# Altium schematic sheet DC CV - SCH.SchDoc
size Legal
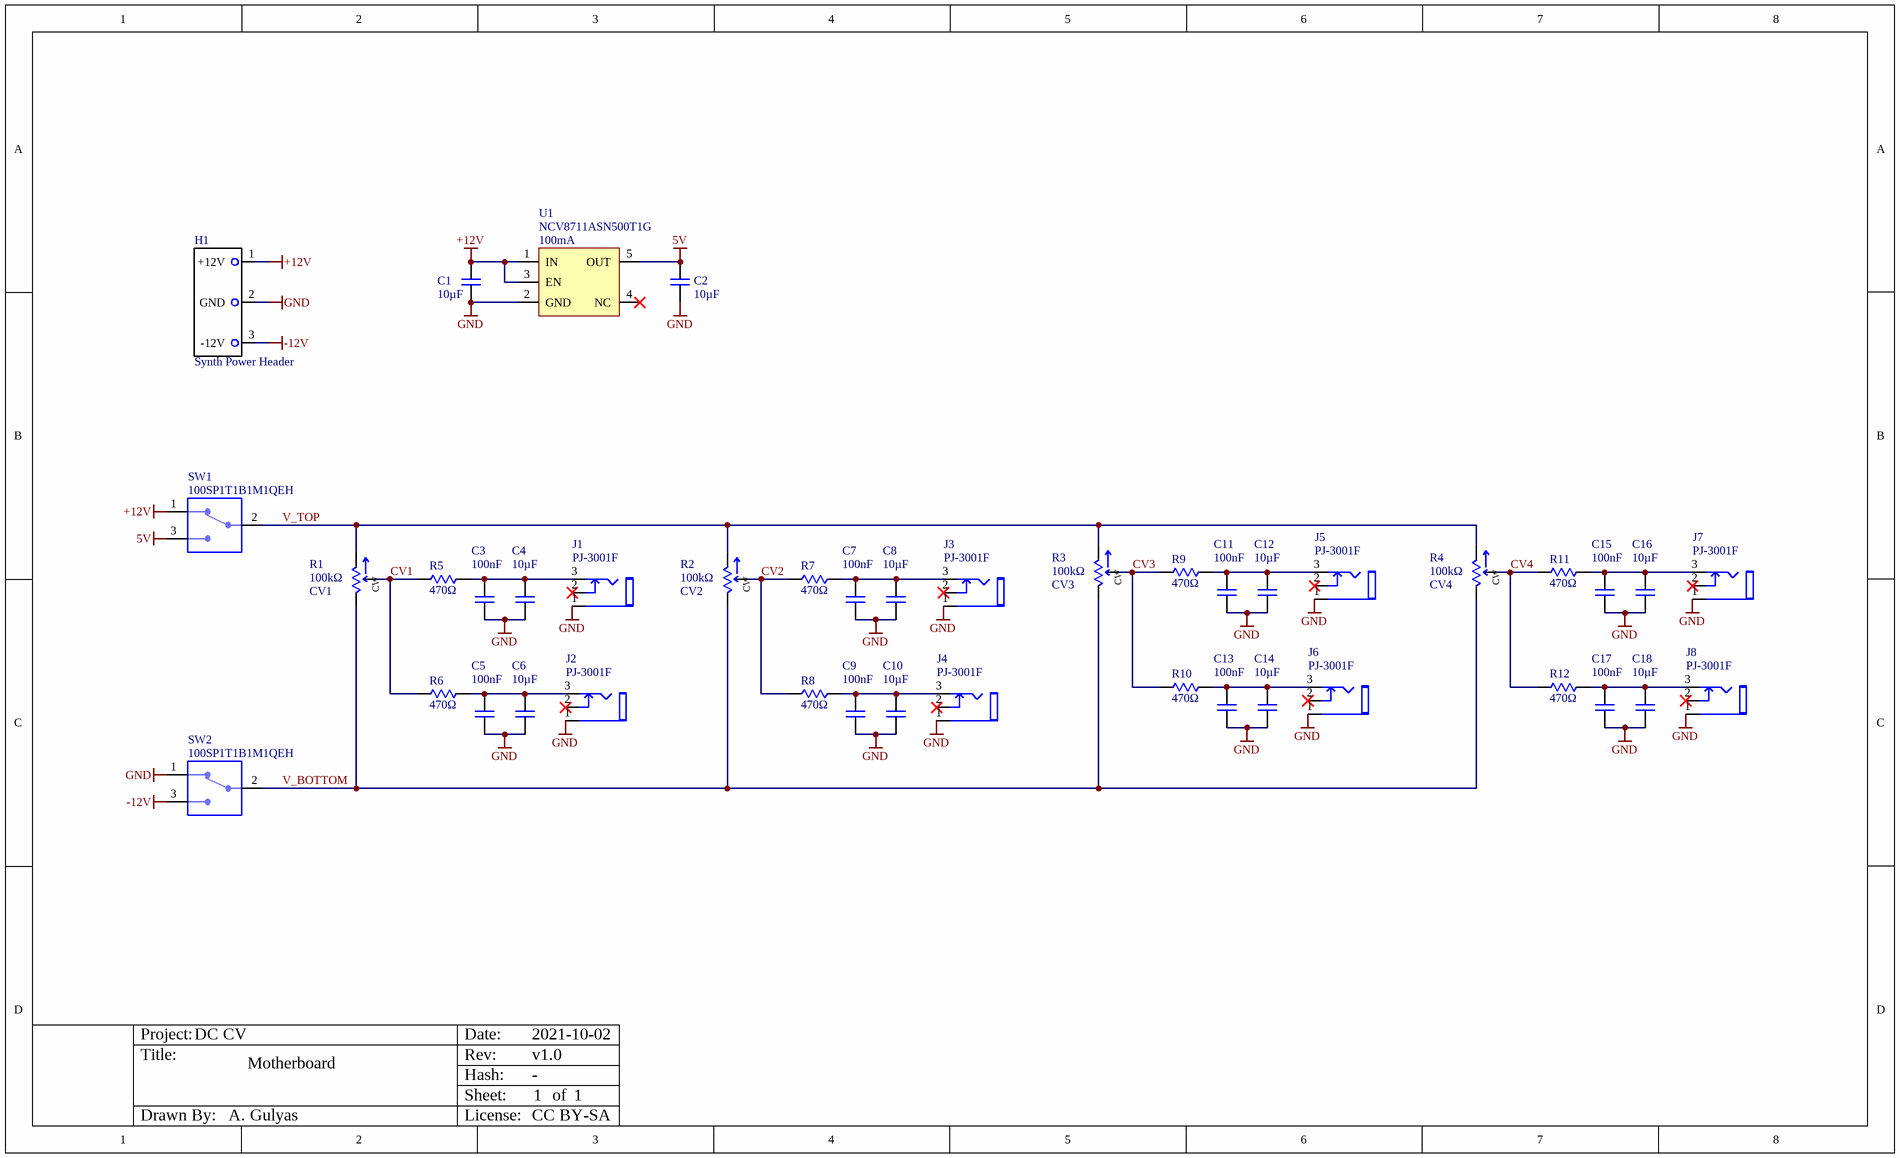
[diagram p0: DC CV - SCH.SchDoc]

## Parts
C1  10µF  [0805 - C]
C2  10µF  [0805 - C]
C3  100nF  [0603 - C]
C4  10µF  [0805 - C]
C5  100nF  [0603 - C]
C6  10µF  [0805 - C]
C7  100nF  [0603 - C]
C8  10µF  [0805 - C]
C9  100nF  [0603 - C]
C10  10µF  [0805 - C]
C11  100nF  [0603 - C]
C12  10µF  [0805 - C]
C13  100nF  [0603 - C]
C14  10µF  [0805 - C]
C15  100nF  [0603 - C]
C16  10µF  [0805 - C]
C17  100nF  [0603 - C]
C18  10µF  [0805 - C]
H1  Synth Power Header  [Eurorack power - 10 pin - DC CV]
J1  PJ-3001F  [Jack - TS - PJ-3001F]
J2  PJ-3001F  [Jack - TS - PJ-3001F]
J3  PJ-3001F  [Jack - TS - PJ-3001F]
J4  PJ-3001F  [Jack - TS - PJ-3001F]
J5  PJ-3001F  [Jack - TS - PJ-3001F]
J6  PJ-3001F  [Jack - TS - PJ-3001F]
J7  PJ-3001F  [Jack - TS - PJ-3001F]
J8  PJ-3001F  [Jack - TS - PJ-3001F]
R1  100kΩ  Purpose: CV1  [Pot - P0915N]
R2  100kΩ  Purpose: CV2  [Pot - P0915N]
R3  100kΩ  Purpose: CV3  [Pot - P0915N]
R4  100kΩ  Purpose: CV4  [Pot - P0915N]
R5  470Ω  [0603 - R]
R6  470Ω  [0603 - R]
R7  470Ω  [0603 - R]
R8  470Ω  [0603 - R]
R9  470Ω  [0603 - R]
R10  470Ω  [0603 - R]
R11  470Ω  [0603 - R]
R12  470Ω  [0603 - R]
SW1  100SP1T1B1M1QEH  [SW - 100SP1T1B1M1QEH]
SW2  100SP1T1B1M1QEH  [SW - 100SP1T1B1M1QEH]
U1  NCV8711ASN500T1G  Current - Output: 100mA  [TSOT 23 5]

## Nets
5V: C2.1 SW1.3 U1.5(OUT)
+12V: C1.1 H1.1(+12V) SW1.1 U1.1(IN) U1.3(EN)
-12V: H1.3(-12V) SW2.3
GND: C1.2 C2.2 C3.2 C4.2 C5.2 C6.2 C7.2 C8.2 C9.2 C10.2 C11.2 C12.2 C13.2 C14.2 C15.2 C16.2 C17.2 C18.2 H1.2(GND) J1.1 J2.1 J3.1 J4.1 J5.1 J6.1 J7.1 J8.1 SW2.1 U1.2(GND)
CV1: R1.2 R5.1 R6.1
CV2: R2.2 R7.1 R8.1
CV3: R3.2 R9.1 R10.1
CV4: R4.2 R11.1 R12.1
V_BOTTOM: R1.1 R2.1 R3.1 R4.1 SW2.2
V_TOP: R1.3 R2.3 R3.3 R4.3 SW1.2
NetC3_1: C3.1 C4.1 J1.3 R5.2
NetC5_1: C5.1 C6.1 J2.3 R6.2
NetC7_1: C7.1 C8.1 J3.3 R7.2
NetC9_1: C9.1 C10.1 J4.3 R8.2
NetC11_1: C11.1 C12.1 J5.3 R9.2
NetC13_1: C13.1 C14.1 J6.3 R10.2
NetC15_1: C15.1 C16.1 J7.3 R11.2
NetC17_1: C17.1 C18.1 J8.3 R12.2

Not connected (* = marked no-connect by the designer): J1 2*; J2 2*; J3 2*; J4 2*; J5 2*; J6 2*; J7 2*; J8 2*; U1 4(NC)*

## Notes on the sheet
- Project:
- DC CV
- Date:
- 2021-10-02
- Title:
- Motherboard
- Rev:
- Hash:
- Sheet:
- v1.0
- -
- 1
- of
- Drawn By:
- A. Gulyas
- License:
- CC BY-SA
- (in symbol R - pot - 100k) CW

## Library data of the parts
C1 C2 C4 C6 C8 C10 C12 C14 C16 C18 = C - 0805 - 10uF - 16V: CAP CER 10UF 16V X5R 0805; MFG: Yageo; MFG PN: CC0805MKX5R7BB106; Tolerance: ±20%; Op Temp: -55°C ~ 85°C; Digi-Key PN: 311-3430-1-ND; Value: 10µF; Package: 0805; Temp Coeff: X5R; Series: CC; Price/1 @10: $0.352; Height: 1.45mm; Composition: ceramic; Voltage - Rated: 16V; Mounting Type: Surface Mount, MLCC
C3 C5 C7 C9 C11 C13 C15 C17 = C - 0603 - 100nF - 16V: CAP CER 0.1UF 16V X7R 0603; MFG: Yageo; MFG PN: CC0603KRX7R7BB104; Value: 0.1µF; Tolerance: ±10%; Op Temp: -55°C ~ 125°C; Digi-Key PN: 311-1088-1-ND; Package: 0603; Temp Coeff: X7R; Series: CC; Price/1 @10: $0.064; Height: 0.9 mm; Composition: Ceramic; Voltage - Rated: 16V; Mounting Type: Surface Mount, MLCC
H1 = H - Synth Power: CONN HEADER VERT 10POS 2.54MM; MFG: 3M; MFG PN: 30310-6002HB; Number of Positions: 10; Pitch - Mating: 0.100"; Material Flammability Rating: UL94 V-0; Current Rating (Amps): 1A; Shrouding: Shrouded - 4 Wall; Contact Length - Mating: 6.00mm; Contact Length - Post: 2.79mm; Op Temp: -55°C ~ 105°C; Digi-Key PN: 30310-6002HB-ND; Series: 303; Mounting Type: Through Hole; Fastening Type: Push-Pull; Termination: Solder; Insulation Material: Polybutylene Terephthalate (PBT), Polyester, Glass Filled; Number of Rows: 2; Price/1 @10: $0.815; Contact Type: Male Pin; Row Spacing - Mating: 0.100"; Insulation Height: 9.30mm; Features: Keying Slot
J1-J8 = Jack - TS - PJ-3001F: 3.5MM MONO PHONE JACK WITH SWITCH; MFG: Tayda Electronics; Vendor PN: A-2563; Rated Current: 1A; Rated Voltage: 12VDC; ComponentLink1Description: Datasheet; ComponentLink1URL: E:\!Projects\!31. Hackathon Synth\basic-synth\modules\VCA\v1.1.0\Datasheets\PJ-3001F - TS Jack.jpeg; ComponentLink2Description: Online Datasheet; ComponentLink2URL: https://www.taydaelectronics.com/datasheets/files/A-2563.jpeg; ComponentLink3Description: Store Page; ComponentLink3URL: https://www.taydaelectronics.com/pj-3001f-3-5-mm-mono-phone-jack.html; MFG PN: PJ-3001F; Digi-Key PN: -; Mounting Type: Panel Mounting; Price/1 @10: $0.23
R1-R4 = R - pot - 100k: POT 100K OHM 1/20W PLASTIC LIN; MFG: TT Electronics; MFG PN: P0915N-FC15BR100K; Power (Watts): 50mW; Tolerance: ±20%; Adjustment Type: Top Adjustment; Resistive Material: Conductive Plastic; Number of Turns: 1; Rotation: 300°; Actuator Type: Flatted; Bushing Thread: M7 x 0.75; Digi-Key PN: 987-1709-ND; Price/1 @10: $1.66; ComponentLink1Description: Datasheet; ComponentLink1URL: E:\!Projects\!31. Hackathon Synth\basic-synth\modules\VCA\v1.1.0\Datasheets\TT Electronics - P09x Series.pdf; ComponentLink2Description: Online Datasheet; ComponentLink2URL: https://www.mouser.ca/datasheet/2/414/P09x-1545427.pdf; Series: P09x; Mounting Type: Panel Mount; Termination Style: PC Pins, Board Locks; Size - Body: Rectangular - 11.35mm x 9.50mm Face x 7.45mm H; Resistance: 100k; Taper: Linear; Number of Gangs: 1
R5-R12 = R - 0603 - 470R: RES SMD 470 OHM 5% 1/10W 0603; MFG PN: RC0603JR-07470RL; MFG: Yageo; Power: 0.1W; Temp Coeff: ±100ppm/°C; Op Temp: -55°C ~ 155°C; Value: 470 Ohms; Digi-Key PN: 311-470GRCT-ND; Price/1 @10: $0.02500; Height: 0.55mm; Package: 0603; Composition: Thick Film; Tolerance: 5%; Series: RC; Mounting Type: Surface Mount; ComponentLink1Description: Datasheet; ComponentLink1URL: E:\!Projects\50. XInC2 Dev 2\git\Datasheets\Yageo - RC series.pdf; ComponentLink2Description: Online Datasheet; ComponentLink2URL: https://www.yageo.com/upload/media/product/productsearch/datasheet/rchip/PYu-RC_Group_51_RoHS_L_11.pdf
SW1 SW2 = SW - SPDT - toggle - 100SP1T1B1M1QEH: SWITCH TOGGLE SPDT 5A 120V; MFG: E-Switch; op temp: -30°C ~ 85°C; Switch Function: On-On; Current Rating (Amps): 5A (AC/DC); Voltage Rating - DC: 28 V; Digi-Key PN: EG2350-ND; MFG PN: 100SP1T1B1M1QEH; Mounting Type: Panel Mount; price/1 @10: $3.163; Series: 100; Circuit: SPDT; Termination Style: Solder Lug; Bushing Thread: 1/4-40
U1 = Reg - Lin - 5V - NCV8711ASN500T1G: IC REG LINEAR 5V 100MA 5TSOP; Current - Quiescent (Iq): 2.5 µA; MFG: onsemi; Number of Outputs: 1; op temp: -40°C ~ 125°C (TJ); Output Configuration: Positive; Output Type: Fixed; Protection Features: Over Current, Over Temperature; Voltage - Dropout: 0.355V @ 100mA; Voltage - Input (Max): 18V; Digi-Key PN: 488-NCV8711ASN500T1GCT-ND; MFG PN: NCV8711ASN500T1G; Mounting Type: Surface Mount; package: SOT-23-5 Thin, TSOT-23-5; price/1 @10: $0.915; Series: Automotive, AEC-Q100; Voltage - Output (Max): -; Voltage - Output (Min/Fixed): 5V